# EAGLE design TIP120_breakout (EAGLE 8.3.1)
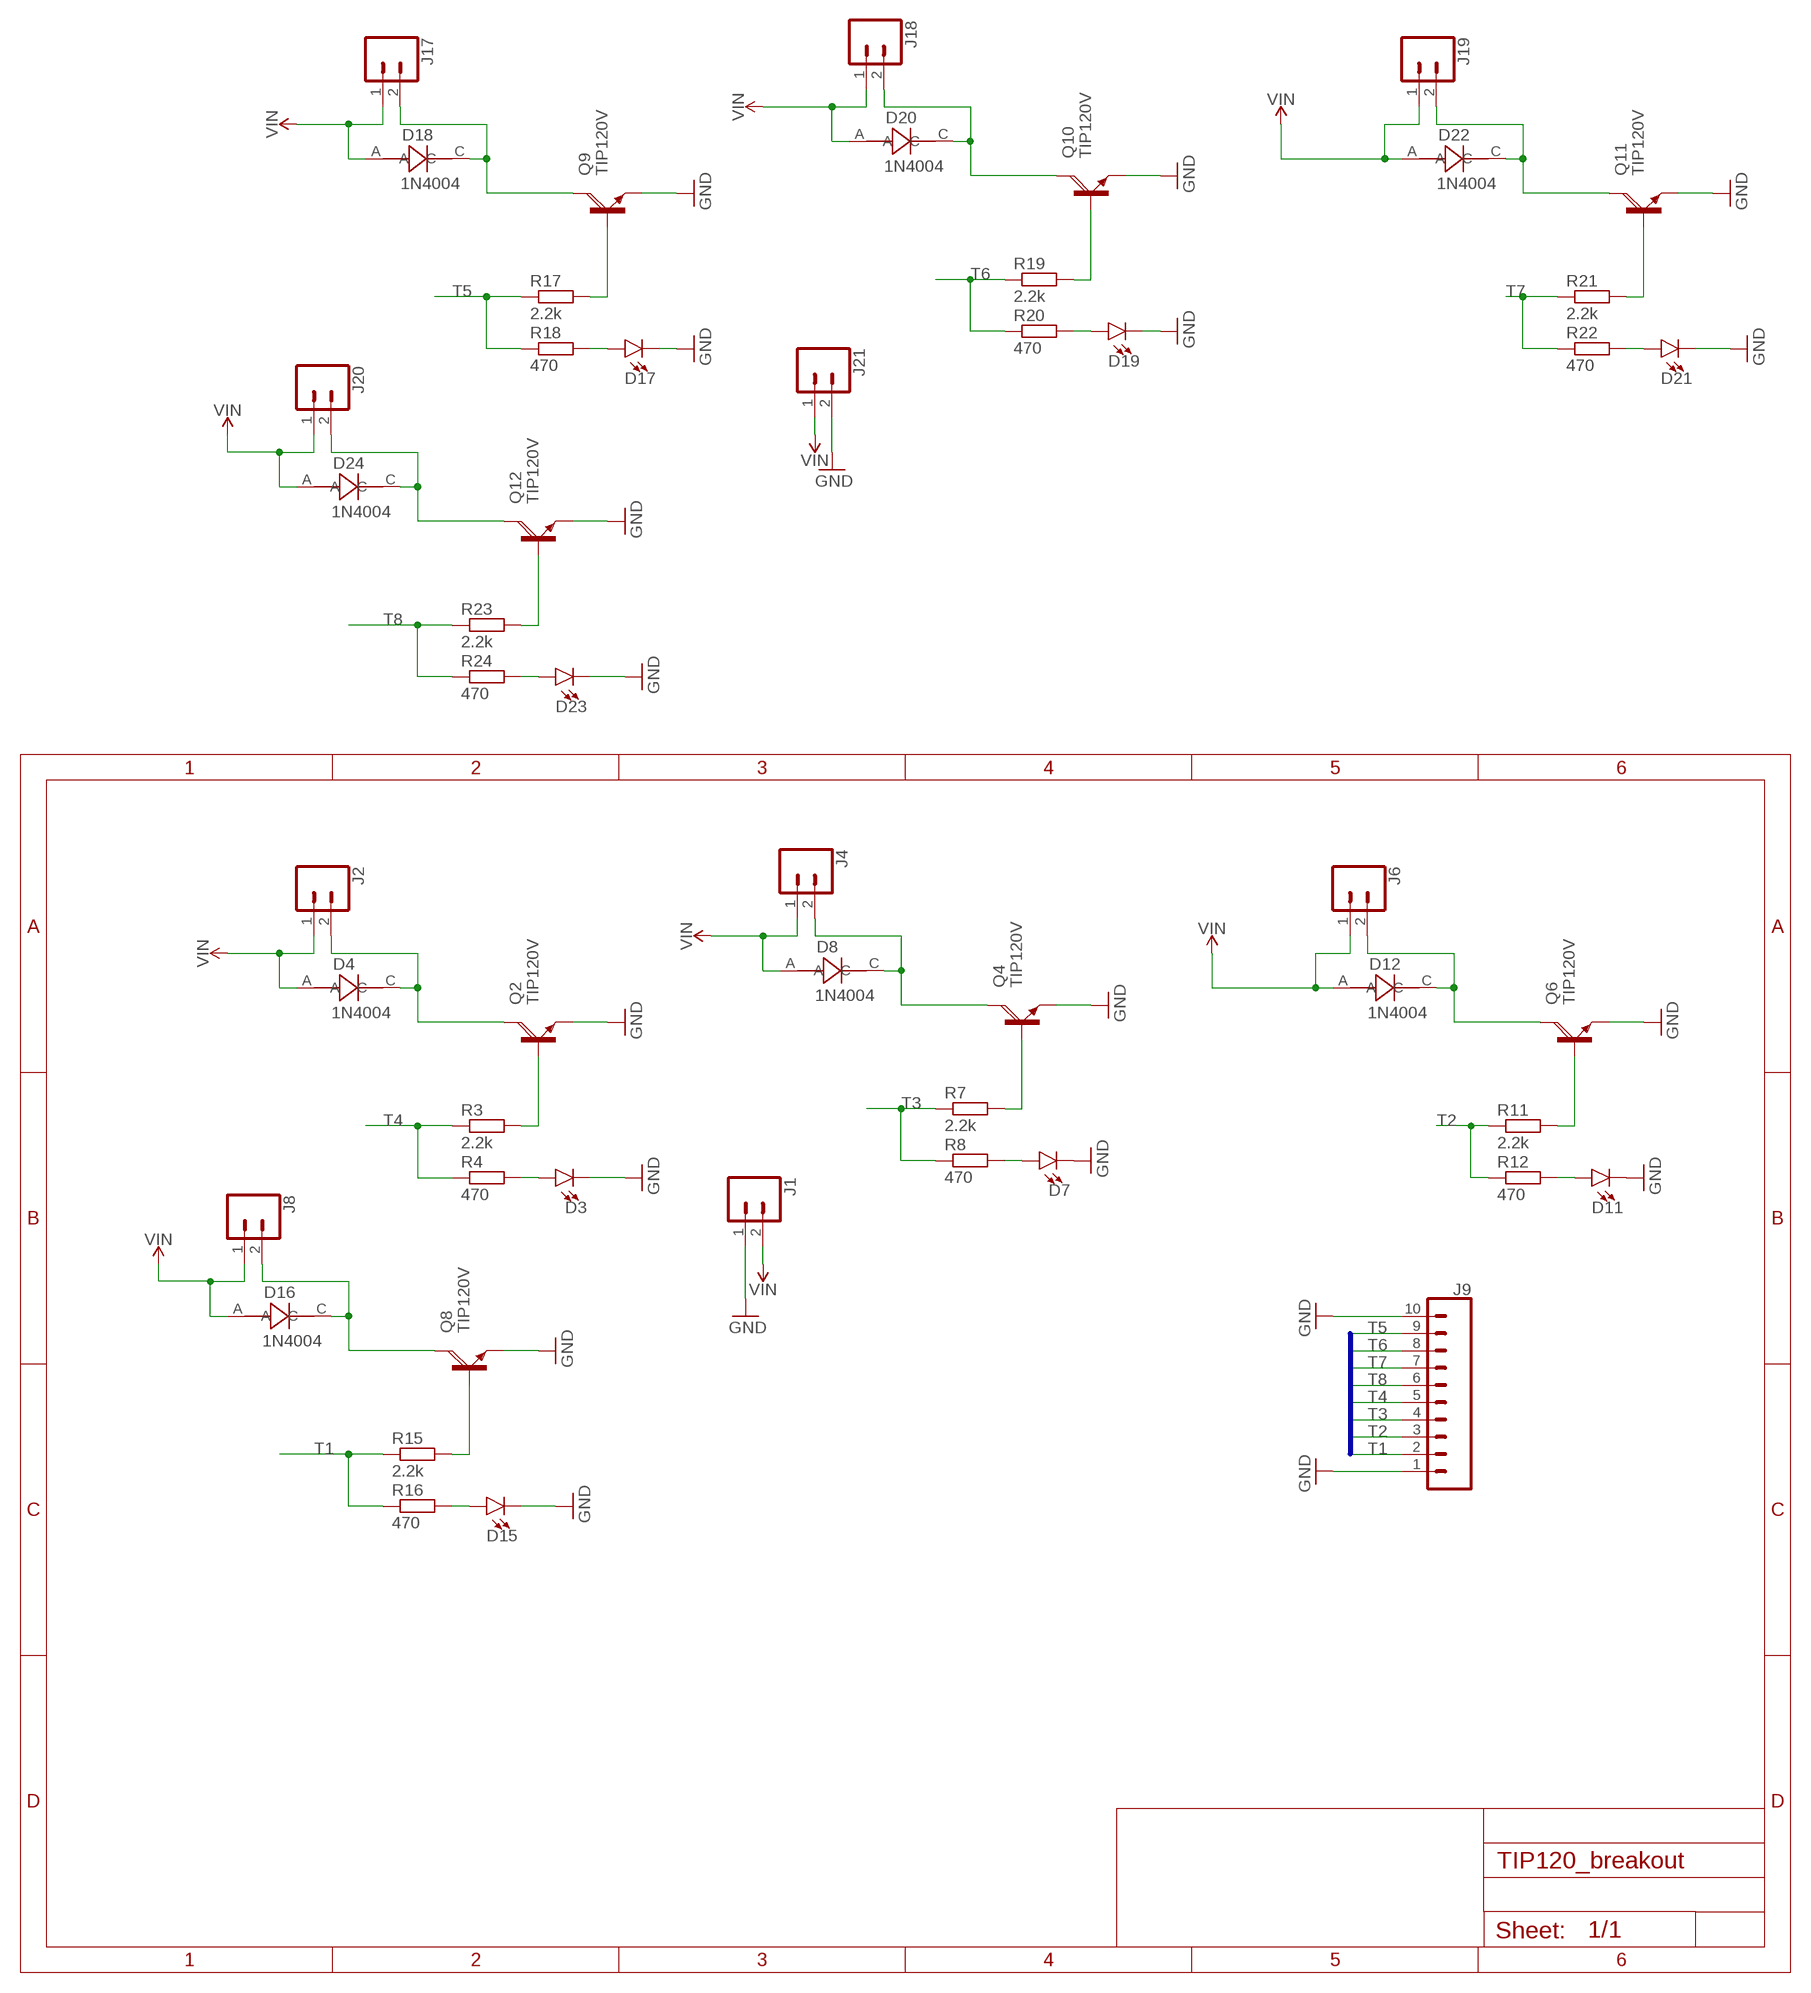
[diagram p0: schematic, sheet 1]

## Parts
D3  LED3MM  [LED_3MM]
D4  1N4004  [1N4004_DIOAD520W79L463D238]
D7  LED3MM  [LED_3MM]
D8  1N4004  [1N4004_DIOAD520W79L463D238]
D11  LED3MM  [LED_3MM]
D12  1N4004  [1N4004_DIOAD520W79L463D238]
D15  LED3MM  [LED_3MM]
D16  1N4004  [1N4004_DIOAD520W79L463D238]
D17  LED3MM  [LED_3MM]
D18  1N4004  [1N4004_DIOAD520W79L463D238]
D19  LED3MM  [LED_3MM]
D20  1N4004  [1N4004_DIOAD520W79L463D238]
D21  LED3MM  [LED_3MM]
D22  1N4004  [1N4004_DIOAD520W79L463D238]
D23  LED3MM  [LED_3MM]
D24  1N4004  [1N4004_DIOAD520W79L463D238]
J1  CONN_025MM  [SCREWTERMINAL-5MM-2]
J2  CONN_025MM  [SCREWTERMINAL-5MM-2]
J4  CONN_025MM  [SCREWTERMINAL-5MM-2]
J6  CONN_025MM  [SCREWTERMINAL-5MM-2]
J8  CONN_025MM  [SCREWTERMINAL-5MM-2]
J9  CONN_10"  [1X10]
J17  CONN_025MM  [SCREWTERMINAL-5MM-2]
J18  CONN_025MM  [SCREWTERMINAL-5MM-2]
J19  CONN_025MM  [SCREWTERMINAL-5MM-2]
J20  CONN_025MM  [SCREWTERMINAL-5MM-2]
J21  CONN_025MM  [SCREWTERMINAL-5MM-2]
Q2  TIP120V  [TO220AV]
Q4  TIP120V  [TO220AV]
Q6  TIP120V  [TO220AV]
Q8  TIP120V  [TO220AV]
Q9  TIP120V  [TO220AV]
Q10  TIP120V  [TO220AV]
Q11  TIP120V  [TO220AV]
Q12  TIP120V  [TO220AV]
R3  2.2k  R-EU_0207/7  [0207/7]
R4  470  R-EU_0207/7  [0207/7]
R7  2.2k  R-EU_0207/7  [0207/7]
R8  470  R-EU_0207/7  [0207/7]
R11  2.2k  R-EU_0207/7  [0207/7]
R12  470  R-EU_0207/7  [0207/7]
R15  2.2k  R-EU_0207/7  [0207/7]
R16  470  R-EU_0207/7  [0207/7]
R17  2.2k  R-EU_0207/7  [0207/7]
R18  470  R-EU_0207/7  [0207/7]
R19  2.2k  R-EU_0207/7  [0207/7]
R20  470  R-EU_0207/7  [0207/7]
R21  2.2k  R-EU_0207/7  [0207/7]
R22  470  R-EU_0207/7  [0207/7]
R23  2.2k  R-EU_0207/7  [0207/7]
R24  470  R-EU_0207/7  [0207/7]

## Nets
GND: D3.K(C) D7.K(C) D11.K(C) D15.K(C) D17.K(C) D19.K(C) D21.K(C) D23.K(C) J1.1 J9.1 J9.10 J21.2 Q2.E Q4.E Q6.E Q8.E Q9.E Q10.E Q11.E Q12.E
N$3: Q2.B R3.2
N$5: D3.A R4.2
N$6: D4.C J2.2 Q2.C
N$10: Q4.B R7.2
N$11: D7.A R8.2
N$12: D8.C J4.2 Q4.C
N$16: Q6.B R11.2
N$17: D11.A R12.2
N$18: D12.C J6.2 Q6.C
N$22: Q8.B R15.2
N$23: D15.A R16.2
N$24: D16.C J8.2 Q8.C
N$31: Q9.B R17.2
N$32: D17.A R18.2
N$33: D18.C J17.2 Q9.C
N$34: Q10.B R19.2
N$35: D19.A R20.2
N$36: D20.C J18.2 Q10.C
N$37: Q11.B R21.2
N$38: D21.A R22.2
N$39: D22.C J19.2 Q11.C
N$40: Q12.B R23.2
N$41: D23.A R24.2
N$42: D24.C J20.2 Q12.C
T1: J9.2 R15.1 R16.1
T2: J9.3 R11.1 R12.1
T3: J9.4 R7.1 R8.1
T4: J9.5 R3.1 R4.1
T5: J9.9 R17.1 R18.1
T6: J9.8 R19.1 R20.1
T7: J9.7 R21.1 R22.1
T8: J9.6 R23.1 R24.1
VIN: D4.A D8.A D12.A D16.A D18.A D20.A D22.A D24.A J1.2 J2.1 J4.1 J6.1 J8.1 J17.1 J18.1 J19.1 J20.1 J21.1

## Buses
T[1..8]

## Library data of the parts
D3 D7 D11 D15 D17 D19 D21 D23 = TIP120_breakout:LED: LED (Generic) Standard schematic elements and footprints for 5mm, 3mm, 1206, and 0603 sized LEDs. Generic LEDs with no color specified.; PROD_ID: DIO-08794
D4 D8 D12 D16 D18 D20 D22 D24 = TIP120_breakout:1N4004: 1N400 Series 400 V 1 A Through Hole General Purpose Rectifier - DO-41; MANUFACTURER: Fairchild Semiconductor
J1 J2 J4 J6 J8 J17-J21 = TIP120_breakout:CONN_02: Multi connection point. Often used as Generic Header-pin footprint for 0.1 inch spaced/style header connections On any of the 0.1 inch spaced packages, you can populate with these: Break Away Headers - Straight <https://www.sparkfun.com/products/116> (PRT-00116) Break Away Male Headers - Right Angle <https://www.sparkfun.com/products/553> (PRT-00553) Female Headers <https://www.sparkfun.com/products/115> (PRT-00115) Break Away Headers - Machine Pin <https://www.sparkfun.com/products/117> (PRT-00117) Break Away Female Headers - Swiss Machine Pin <https://www.sparkfun.com/products/743> (PRT-00743) For SCREWTERMINALS and SPRING TERMINALS visit here: Screw Terimnals on SparkFun.com <https://www.sparkfun.com/search/results?term=Screw+Terminals> (5mm/3.5mm/2.54mm spacing) This device is also useful as a general connection point to wire up your design to another part of your project. Our various solder wires solder well into these plated through hole pads. Hook-Up Wire - Assortment (Stranded, 22 AWG) <https://www.sparkfun.com/products/11375> (PRT-11375) Hook-Up Wire - Assortment (Solid Core, 22 AWG) <https://www.sparkfun.com/products/11367> (PRT-11367) View the entire wire category on our website here <https://www.sparkfun.com/categories/141> Special notes: Molex polarized connector foot print use with: PRT-08233 with associated crimp pins and housings. 2.54_SCREWTERM for use with PRT-10571. 3.5mm Screw Terminal footprints for PRT-08084 5mm Screw Terminal footprints for use with PRT-08432; SF_SKU: PRT-08432
J9 = TIP120_breakout:CONN_10: Multi connection point. Often used as Generic Header-pin footprint for 0.1 inch spaced/style header connections On any of the 0.1 inch spaced packages, you can populate with these: Break Away Headers - Straight <https://www.sparkfun.com/products/116> (PRT-00116) Break Away Male Headers - Right Angle <https://www.sparkfun.com/products/553> (PRT-00553) Female Headers <https://www.sparkfun.com/products/115> (PRT-00115) Break Away Headers - Machine Pin <https://www.sparkfun.com/products/117> (PRT-00117) Break Away Female Headers - Swiss Machine Pin <https://www.sparkfun.com/products/743> (PRT-00743) Arduino Stackable Header - 10 Pin <https://www.sparkfun.com/products/11376> (PRT-11376) For SCREWTERMINALS and SPRING TERMINALS visit here: Screw Terimnals on SparkFun.com <https://www.sparkfun.com/search/results?term=Screw+Terminals> (5mm/3.5mm/2.54mm spacing) This device is also useful as a general connection point to wire up your design to another part of your project. Our various solder wires solder well into these plated through hole pads. Hook-Up Wire - Assortment (Stranded, 22 AWG) <https://www.sparkfun.com/products/11375> (PRT-11375) Hook-Up Wire - Assortment (Solid Core, 22 AWG) <https://www.sparkfun.com/products/11367> (PRT-11367) View the entire wire category on our website here <https://www.sparkfun.com/categories/141> Special notes: Molex polarized connector foot print use with SKU : PRT-08231 with associated crimp pins and housings. 1MM SMD Version SKU: PRT-10208 NOTES ON THE VARIANTS LOCK and LOCK_LONGPADS... This footprint was designed to help hold the alignment of a through-hole component (i.e. 6-pin header) while soldering it into place. You may notice that each hole has been shifted either up or down by 0.005 of an inch from it's more standard position (which is a perfectly straight line). This slight alteration caused the pins (the squares in the middle) to touch the edges of the holes. Because they are alternating, it causes a "brace" to hold the component in place. 0.005 has proven to be the perfect amount of "off-center" position when using our standard breakaway headers. Although looks a little odd when you look at the bare footprint, once you have a header in there, the alteration is very hard to notice. Also,if you push a header all the way into place, it is covered up entirely on the bottom side.; PROD_ID: CONN-11563
Q2 Q4 Q6 Q8-Q12 = TIP120_breakout:TIP120: NPN DARLINGTON TRANSISTOR
R3 R4 R7 R8 R11 R12 R15-R24 = rcl:R-EU_: RESISTOR, European symbol

## Board
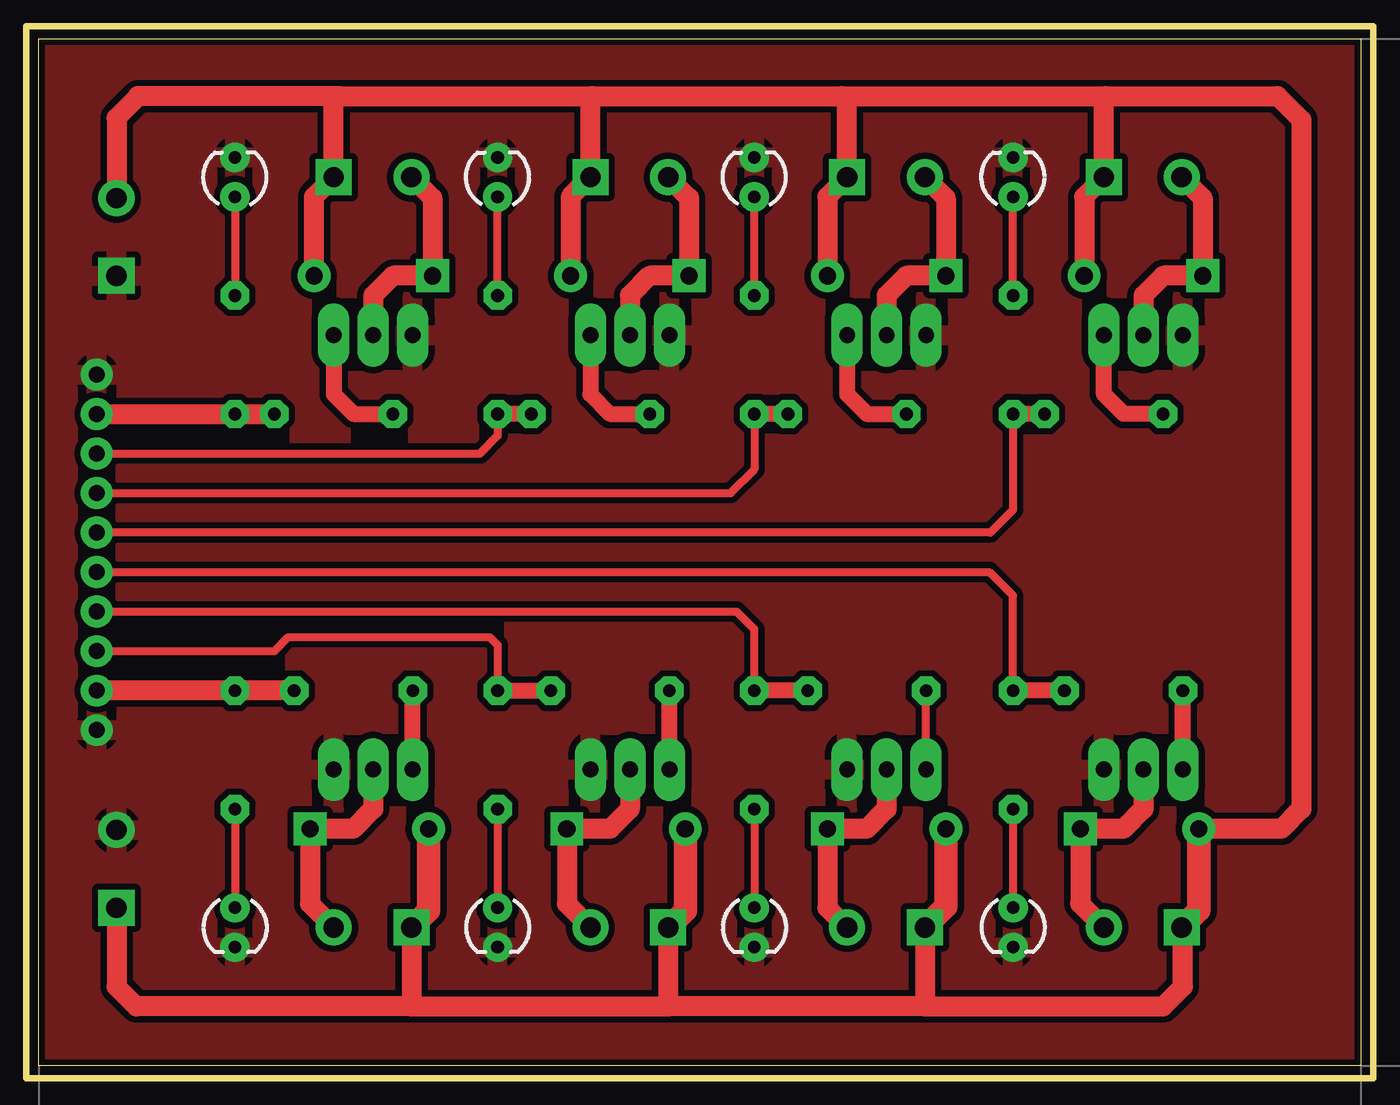
[diagram p1: board, top side]
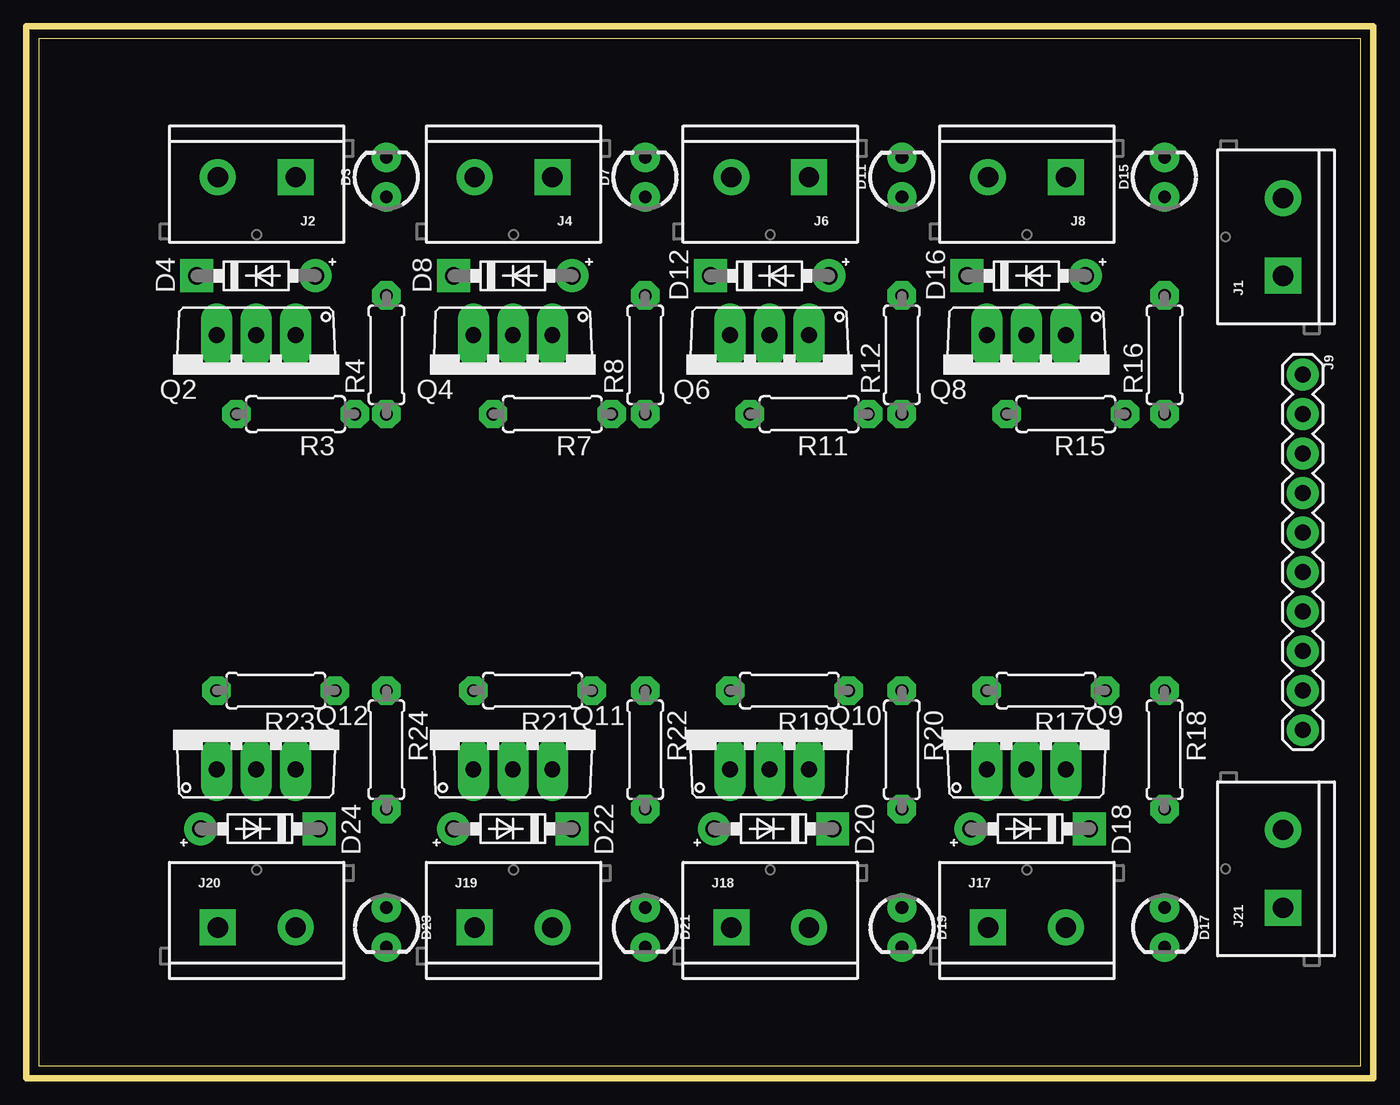
[diagram p2: board, bottom side, seen from below]

Size 85 x 66.04 mm. Coordinates in mm from the lower left corner, seen from the top.
Outline: 85,0 0,0 0,66.04 85,66.04 85,0
Copper layers (1*16): Top 0.035mm / dielectric 1.5mm / Bottom 0.035mm
Design rules "SeeedStudio_2layer_DRU_no_angle_20140221 *": minimum track width 6mil, minimum drill 12mil, track to track 6mil, track to pad 6mil, pad to pad 6mil, via to via 6mil, smd to smd 0mil, copper to edge 10mil, drill to drill 10mil, minimum pad ring 10mil, minimum via ring 6mil, stop-mask expansion 2mil, vias tented up to drill 100mil, thermal gap 16mil
Milling: 4 lines

### Footprints (pad centres in the part's own frame; a part is rotated, then mirrored left to right if it is on the bottom)
LED_3MM = drill 0.813 pad 1.88: A -1.27,0; K 1.27,0
1N4004_DIOAD520W79L463D238 = drill 1.1 pad 1.7: A 3.81,0 | drill 1.1 pad 1.7 square: C -3.81,0
SCREWTERMINAL-5MM-2 = drill 1.3 pad 2.032 square: 1 0,0 | drill 1.3 pad 2.032: 2 5,0
1X10 = drill 1.016 pad 1.88: 1 0,0; 2 2.54,0; 3 5.08,0; 4 7.62,0; 5 10.16,0; 6 12.7,0; 7 15.24,0; 8 17.78,0; 9 20.32,0; 10 22.86,0
TO220AV = drill 1.016 long: B -2.54,-2.54; C 0,-2.54; E 2.54,-2.54
0207/7 = drill 0.813 octagon: 1 -3.81,0; 2 3.81,0

### Placement (x,y rotation side)
D3  62.65,57.15 90 bottom
D4  71.03,50.8 0 bottom
D7  46.01,57.15 90 bottom
D8  54.52,50.8 0 bottom
D11  29.5,57.15 90 bottom
D12  38.01,50.8 0 bottom
D15  12.61,57.15 90 bottom
D16  21.5,50.8 0 bottom
D17  12.61,8.89 270 bottom
D18  21.25,15.24 180 bottom
D19  29.5,8.89 270 bottom
D20  37.76,15.24 180 bottom
D21  46.01,8.89 270 bottom
D22  54.52,15.24 180 bottom
D23  62.65,8.89 270 bottom
D24  70.78,15.24 180 bottom
J1  4.99,50.8 90 bottom
J2  68.49,57.15 180 bottom
J4  51.98,57.15 180 bottom
J6  35.47,57.15 180 bottom
J8  18.96,57.15 180 bottom
J9  3.72,44.45 270 bottom
J17  23.96,8.89 0 bottom
J18  40.47,8.89 0 bottom
J19  56.98,8.89 0 bottom
J20  73.49,8.89 0 bottom
J21  4.99,10.16 90 bottom
Q2  71.03,44.45 180 bottom
Q4  54.52,44.45 180 bottom
Q6  38.01,44.45 180 bottom
Q8  21.5,44.45 180 bottom
Q9  21.5,21.59 0 bottom
Q10  38.01,21.59 0 bottom
Q11  54.52,21.59 0 bottom
Q12  71.03,21.59 0 bottom
R3  68.49,41.91 180 bottom
R4  62.65,45.72 90 bottom
R7  51.98,41.91 180 bottom
R8  46.01,45.72 90 bottom
R11  35.47,41.91 180 bottom
R12  29.5,45.72 90 bottom
R15  18.96,41.91 180 bottom
R16  12.61,45.72 90 bottom
R17  20.23,24.13 180 bottom
R18  12.61,20.32 270 bottom
R19  36.74,24.13 180 bottom
R20  29.5,20.32 270 bottom
R21  53.25,24.13 180 bottom
R22  46.01,20.32 270 bottom
R23  69.76,24.13 180 bottom
R24  62.65,20.32 270 bottom

### Tracks (layer width: path | path; a pad name or v marks a point on that pad's centre or on a via)
GND
  pour Top (isolate 0.406): 85,66.04 -0.09,66.04 -0.09,0 85,0
N$3
  Top 1.016: R3.2 69.76,41.91 68.49,43.18 Q2.B
N$5
  Top 0.508: R4.2 D3.A
N$6
  Top 1.27: J2.2 74.84,55.8 D4.C 72.3,50.8 71.03,49.53 Q2.C
N$10
  Top 1.016: Q4.B 51.98,43.18 53.25,41.91 R7.2
N$11
  Top 0.508: R8.2 D7.A
N$12
  Top 1.27: J4.2 58.33,55.8 D8.C 55.79,50.8 54.52,49.53 Q4.C
N$16
  Top 1.016: Q6.B 35.47,43.18 36.74,41.91 R11.2
N$17
  Top 0.508: R12.2 D11.A
N$18
  Top 1.27: J6.2 41.82,55.8 D12.C 39.28,50.8 38.01,49.53 Q6.C
N$22
  Top 1.016: Q8.B 18.96,43.18 20.23,41.91 R15.2
N$23
  Top 0.508: D15.A R16.2
N$24
  Top 1.27: J8.2 25.31,55.8 D16.C 22.77,50.8 21.5,49.53 Q8.C
N$31
  Top 1.016: Q9.B R17.2
N$32
  Top 0.508: R18.2 D17.A
N$33
  Top 1.27: Q9.C 21.5,16.51 20.23,15.24 D18.C 17.44,10.41 J17.2
N$34
  Top 1.016: Q10.B R19.2
N$35
  Top 0.508: R20.2 D19.A
N$36
  Top 1.27: Q10.C 38.01,16.51 36.74,15.24 D20.C 33.95,10.41 J18.2
N$37
  Top 0.508: Q11.B R21.2
N$38
  Top 0.508: R22.2 D21.A
N$39
  Top 1.27: Q11.C 54.52,16.51 53.25,15.24 D22.C 50.71,10.16 J19.2
N$40
  Top 1.016: Q12.B R23.2
N$41
  Top 0.508: R24.2 D23.A
N$42
  Top 1.27: Q12.C 71.03,16.51 69.76,15.24 D24.C 66.97,10.41 J20.2
T1
  Top 1.27: J9.2 R16.1 R15.1
T2
  Top 0.508: J9.3 28.36,39.37 29.5,40.51 R12.1
  Top 1.016: R11.1 R12.1
T3
  Top 0.508: J9.4 44.49,36.83 46.01,38.35 R8.1
  Top 1.016: R7.1 R8.1
T4
  Top 0.508: J9.5 61.19,34.29 62.65,35.75 R4.1
  Top 1.016: R3.1 R4.1
T5
  Top 1.27: J9.9 R18.1 R17.1
T6
  Top 0.508: R20.1 29.5,27.05 28.99,27.56 16.04,27.56 15.15,26.67 J9.8
  Top 1.016: R20.1 R19.1
T7
  Top 0.508: J9.7 44.87,29.21 46.01,28.07 46.01,24.28 | 46.01,24.28 R22.1 | 46.16,24.13 46.01,24.28
  Top 1.016: R21.1 46.16,24.13
T8
  Top 0.508: J9.6 61.12,31.75 62.65,30.23 62.65,24.59 | 62.65,24.59 R24.1 | 63.1,24.13 62.65,24.59
  Top 1.016: R23.1 63.1,24.13
VIN
  Top 1.27: D16.A 17.69,55.88 J8.1 18.96,62.02 19.3,62.36 | 24.04,8.81 J17.1 23.96,3.81 | D4.A 67.22,55.88 J2.1 68.49,62.26 68.59,62.36 | D8.A 50.71,55.88 J4.1 51.98,62.23 51.77,62.23 51.64,62.36 | D12.A 34.2,55.88 J6.1 35.47,62.23 35.6,62.36 | D24.A 79.92,15.24 81.19,16.51 81.19,60.83 79.67,62.36 68.59,62.36 | 51.64,62.36 68.59,62.36 | 35.6,62.36 51.64,62.36 | 19.3,62.36 35.6,62.36 | 19.3,62.36 6.39,62.36 4.99,60.96 J1.2 | J21.1 4.99,5.08 6.26,3.81 23.96,3.81 | 56.98,3.81 40.47,3.81 | 56.98,3.81 72.3,3.81 73.57,5.08 73.57,8.81 J20.1 | 23.96,3.81 40.47,3.81 | J18.1 40.47,3.81 | J19.1 56.98,3.81
  Top 1.524: D24.A 74.59,9.99 J20.1 | D22.A 58.33,10.24 J19.1 | D20.A 41.57,9.99 J18.1 | D18.A 25.06,9.99 J17.1